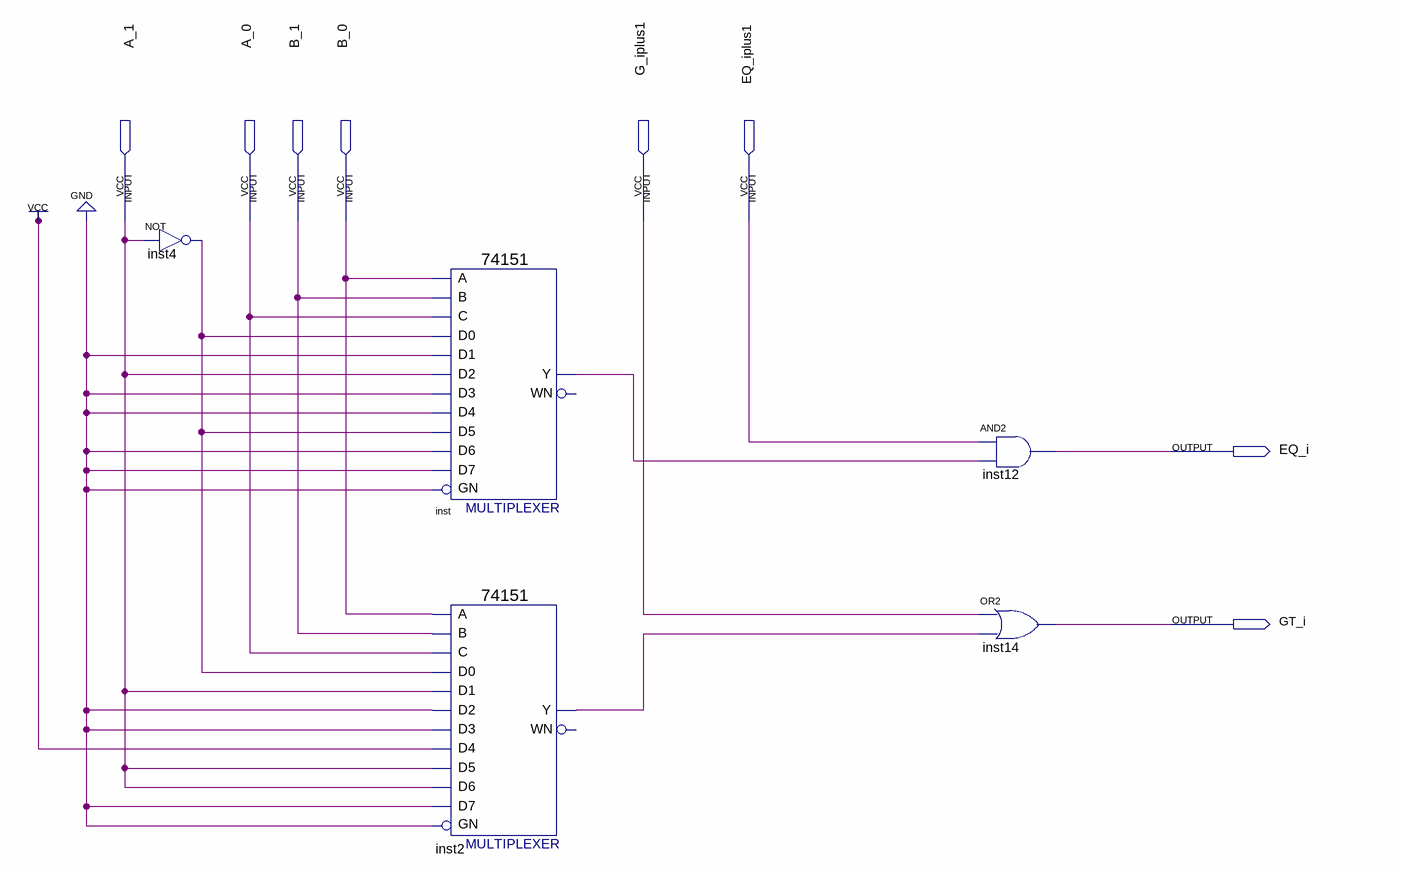
[diagram p0: schematic sheet]
// Quartus schematic 2_bit_comparator.bdf as structural Verilog: 5 symbols, 8 pins
module \2_bit_comparator  (
  input  A_1,
  input  A_0,
  input  B_1,
  input  B_0,
  input  G_iplus1,
  input  EQ_iplus1,
  output EQ_i,
  output GT_i
);

  wire inst2_y, inst4_out, inst_y;

  not inst4 (inst4_out, A_1);
  \74151  inst (
    .GN(1'b0), .C(A_0), .B(B_1), .A(B_0), .D5(inst4_out), .D0(inst4_out), .D1(1'b0), .D4(1'b0), .D3(1'b0),
    .D2(A_1), .D6(1'b0), .D7(1'b0), .Y(inst_y));  // open: WN
  \74151  inst2 (
    .GN(1'b0), .C(A_0), .B(B_1), .A(B_0), .D5(A_1), .D0(inst4_out), .D1(A_1), .D4(1'b1), .D3(1'b0),
    .D2(1'b0), .D6(A_1), .D7(1'b0), .Y(inst2_y));  // open: WN
  and inst12 (EQ_i, EQ_iplus1, inst_y);
  or inst14 (GT_i, G_iplus1, inst2_y);
endmodule
